# Altium schematic sheet RIIM.SchDoc
size A4; SheetNumber: 5; SheetTotal: 7
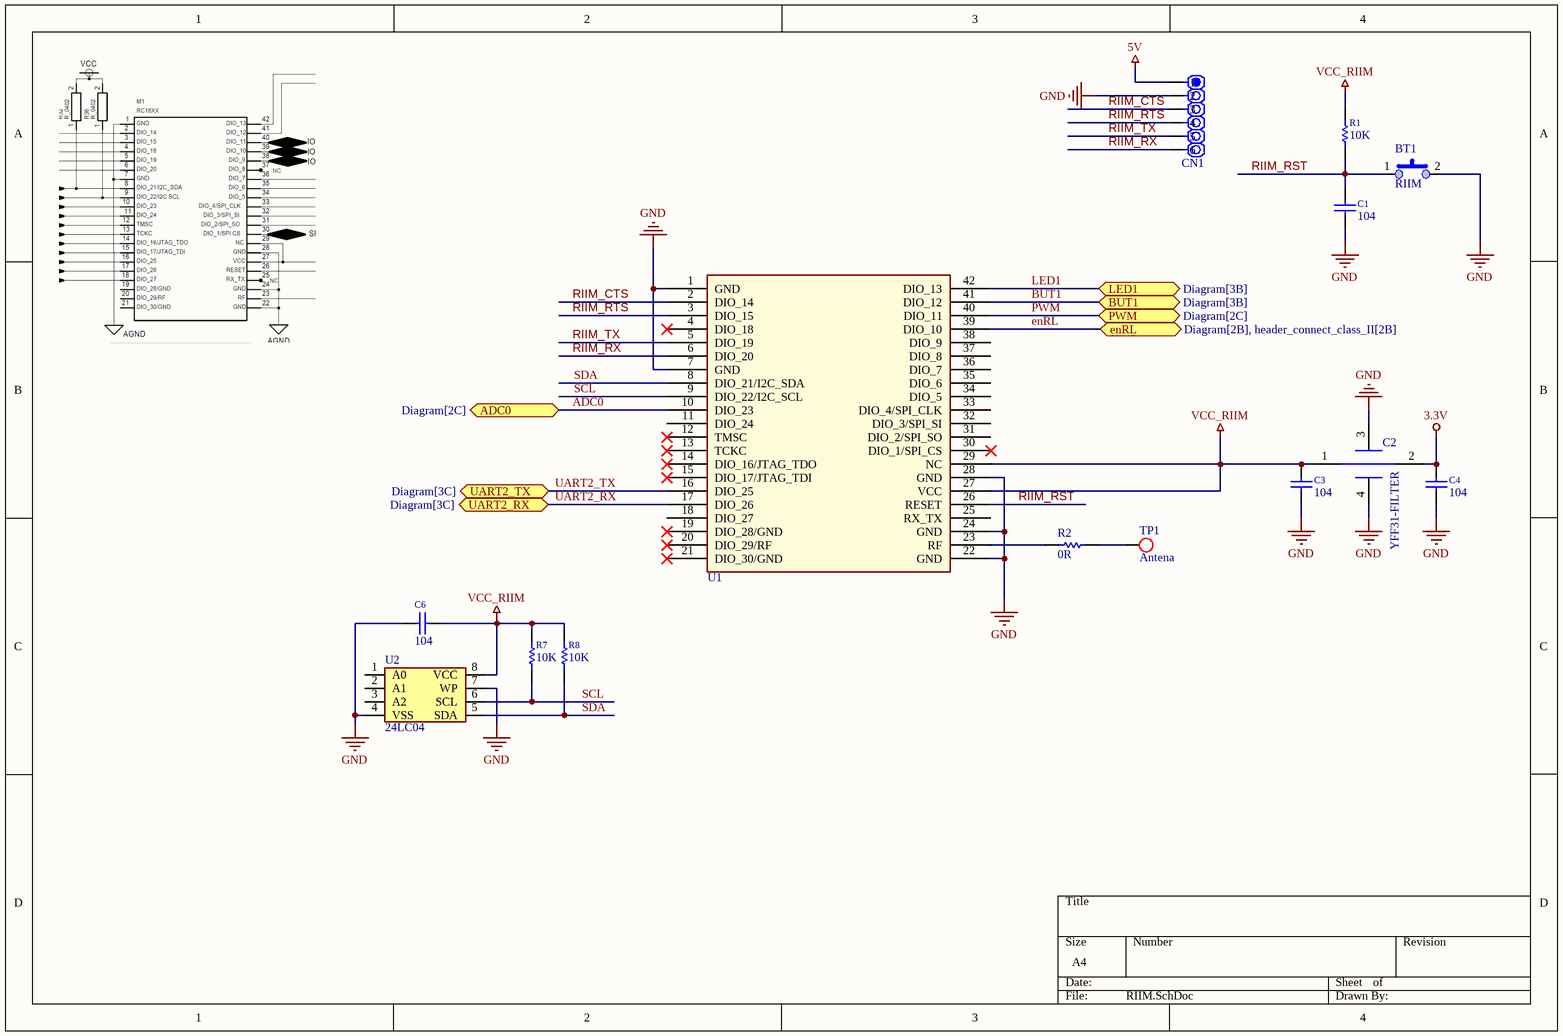
[diagram p0: RIIM.SchDoc]

## Parts
BT1  RIIM  [B3U-1000P]
C1  104  [C2012-0805]
C2  YFF31-FILTER  [YFF31PC]
C3  104  [C2012-0805]
C4  104  [C2012-0805]
C6  104  [C2012-0805]
CN1  RIIM  [CON.HD1X6H]  (value not drawn)
R1  10K  [R2012-0805]
R2  0R  [R2012-0805]
R7  10K  [R2012-0805]
R8  10K  [R2012-0805]
TP1  Antena  [TPoint]
U1  RIIM_RC_1882  [RIIM_RC1882]  (value not drawn)
U2  24LC04  [SOIC8]

## Ports
ADC0 (bidir, see Diagram[2C]), BUT1 (bidir, see Diagram[3B]), enRL (bidir, see Diagram[2B], header_connect_class_II[2B]), LED1 (bidir, see Diagram[3B]), PWM (bidir, see Diagram[2C]), UART2_RX (bidir, see Diagram[3C]), UART2_TX (bidir, see Diagram[3C])

## Nets
3.3V: C2.2(IN/OUT) C4.1
5V: CN1.1
GND: BT1.2 C1.2 C2.3(GND) C2.4(GND) C3.2 C4.2 C6.1 CN1.2 U1.1(GND) U1.7(GND) U1.22(GND) U1.24(GND) U1.28(GND) U2.4(VSS) U2.7(WP)
VCC_RIIM: C2.1(IN/OUT) C3.1 C6.2 R1.1 R7.1 R8.1 U1.27(VCC) U1.29(NC) U2.8(VCC)
ADC0: U1.10(DIO_23) ; port ADC0
BUT1: U1.41(DIO_12) ; port BUT1
enRL: U1.39(DIO_10) ; port enRL
LED1: U1.42(DIO_13) ; port LED1
PWM: U1.40(DIO_11) ; port PWM
RIIM_CTS: CN1.3 U1.2(DIO_14)
RIIM_RST: BT1.1 C1.1 R1.2 U1.26(RESET)
RIIM_RTS: CN1.4 U1.3(DIO_15)
RIIM_RX: CN1.6 U1.6(DIO_20)
RIIM_TX: CN1.5 U1.5(DIO_19)
SCL: R7.2 U1.9(DIO_22/I2C_SCL) U2.6(SCL)
SDA: R8.2 U1.8(DIO_21/I2C_SDA) U2.5(SDA)
UART2_RX: U1.17(DIO_26) ; port UART2_RX
UART2_TX: U1.16(DIO_25) ; port UART2_TX
NetR2_1: R2.1 TP1.1
NetR2_2: R2.2 U1.23(RF)

Not connected (* = marked no-connect by the designer): U1 4(DIO_18)* 11(DIO_24) 12(TMSC)* 13(TCKC)* 14(DIO_16/JTAG_TDO)* 15(DIO_17/JTAG_TDI)* 18(DIO_27) 19(DIO_28/GND)* 20(DIO_29/RF)* 21(DIO_30/GND)* 25(RX_TX) 30(DIO_1/SPI_CS)* 31(DIO_2/SPI_SO) 32(DIO_3/SPI_SI) 33(DIO_4/SPI_CLK) 34(DIO_5) 35(DIO_6) 36(DIO_7) 37(DIO_8) 38(DIO_9); U2 1(A0) 2(A1) 3(A2)

## Library data of the parts
BT1 = Button_2p
C1 C3 C4 C6 = Cap <SMD>: Capacitor; AEMS Code: 2100341; Vendor: Digikey; Volt: 16V; Published: 13-April-2009; Publisher: Hoang Nguyen; ComponentLink1Description: Digikey Part Link; ComponentLink2Description: Open Datasheet; ComponentLink2URL: H:\LIBRARY\LIBRARY.Datasheet\; Value: 104
CN1 = CON.HDR1x6: Header 1x5; Publisher: Hoang Nguyen; ComponentLink1Description: Digikey Part link; ComponentLink2Description: Open DataSheet; ComponentLink2URL: H:\LIBRARY\LIBRARY.Datasheet\
R1 R7 R8 = Resistor <SMD>: Resistor; AEMS Code: 1200430; Vendor: Digikey; Tollerance: 5%; Published: 17-3-2009; Publisher: Hoang Nguyen; ComponentLink1Description: Digikey Part Link; ComponentLink2Description: Open Datasheet; ComponentLink2URL: H:\LIBRARY\LIBRARY.Datasheet\; Value: 10K
R2 = RES 1/4
TP1 = TestPoint
U1 = RIIM_RC_1882: Manufacturer: Radiocrafts; Manufacturer Part Number: RC1882HPCF-IPM; Supplier 1: Digi-Key; RoHS: No; Stock 1: 842; Pricing 1: 1=24.69000, 10=22.78800, 25=20.88880, 100=19.30650, 250=18.99000 (USD); Supplier Part Number 1: 1783-RC1882HPCF-IPMCT-ND
U2 = 24LC512